# Altium project Plant_Monitoring_System.PrjPcb
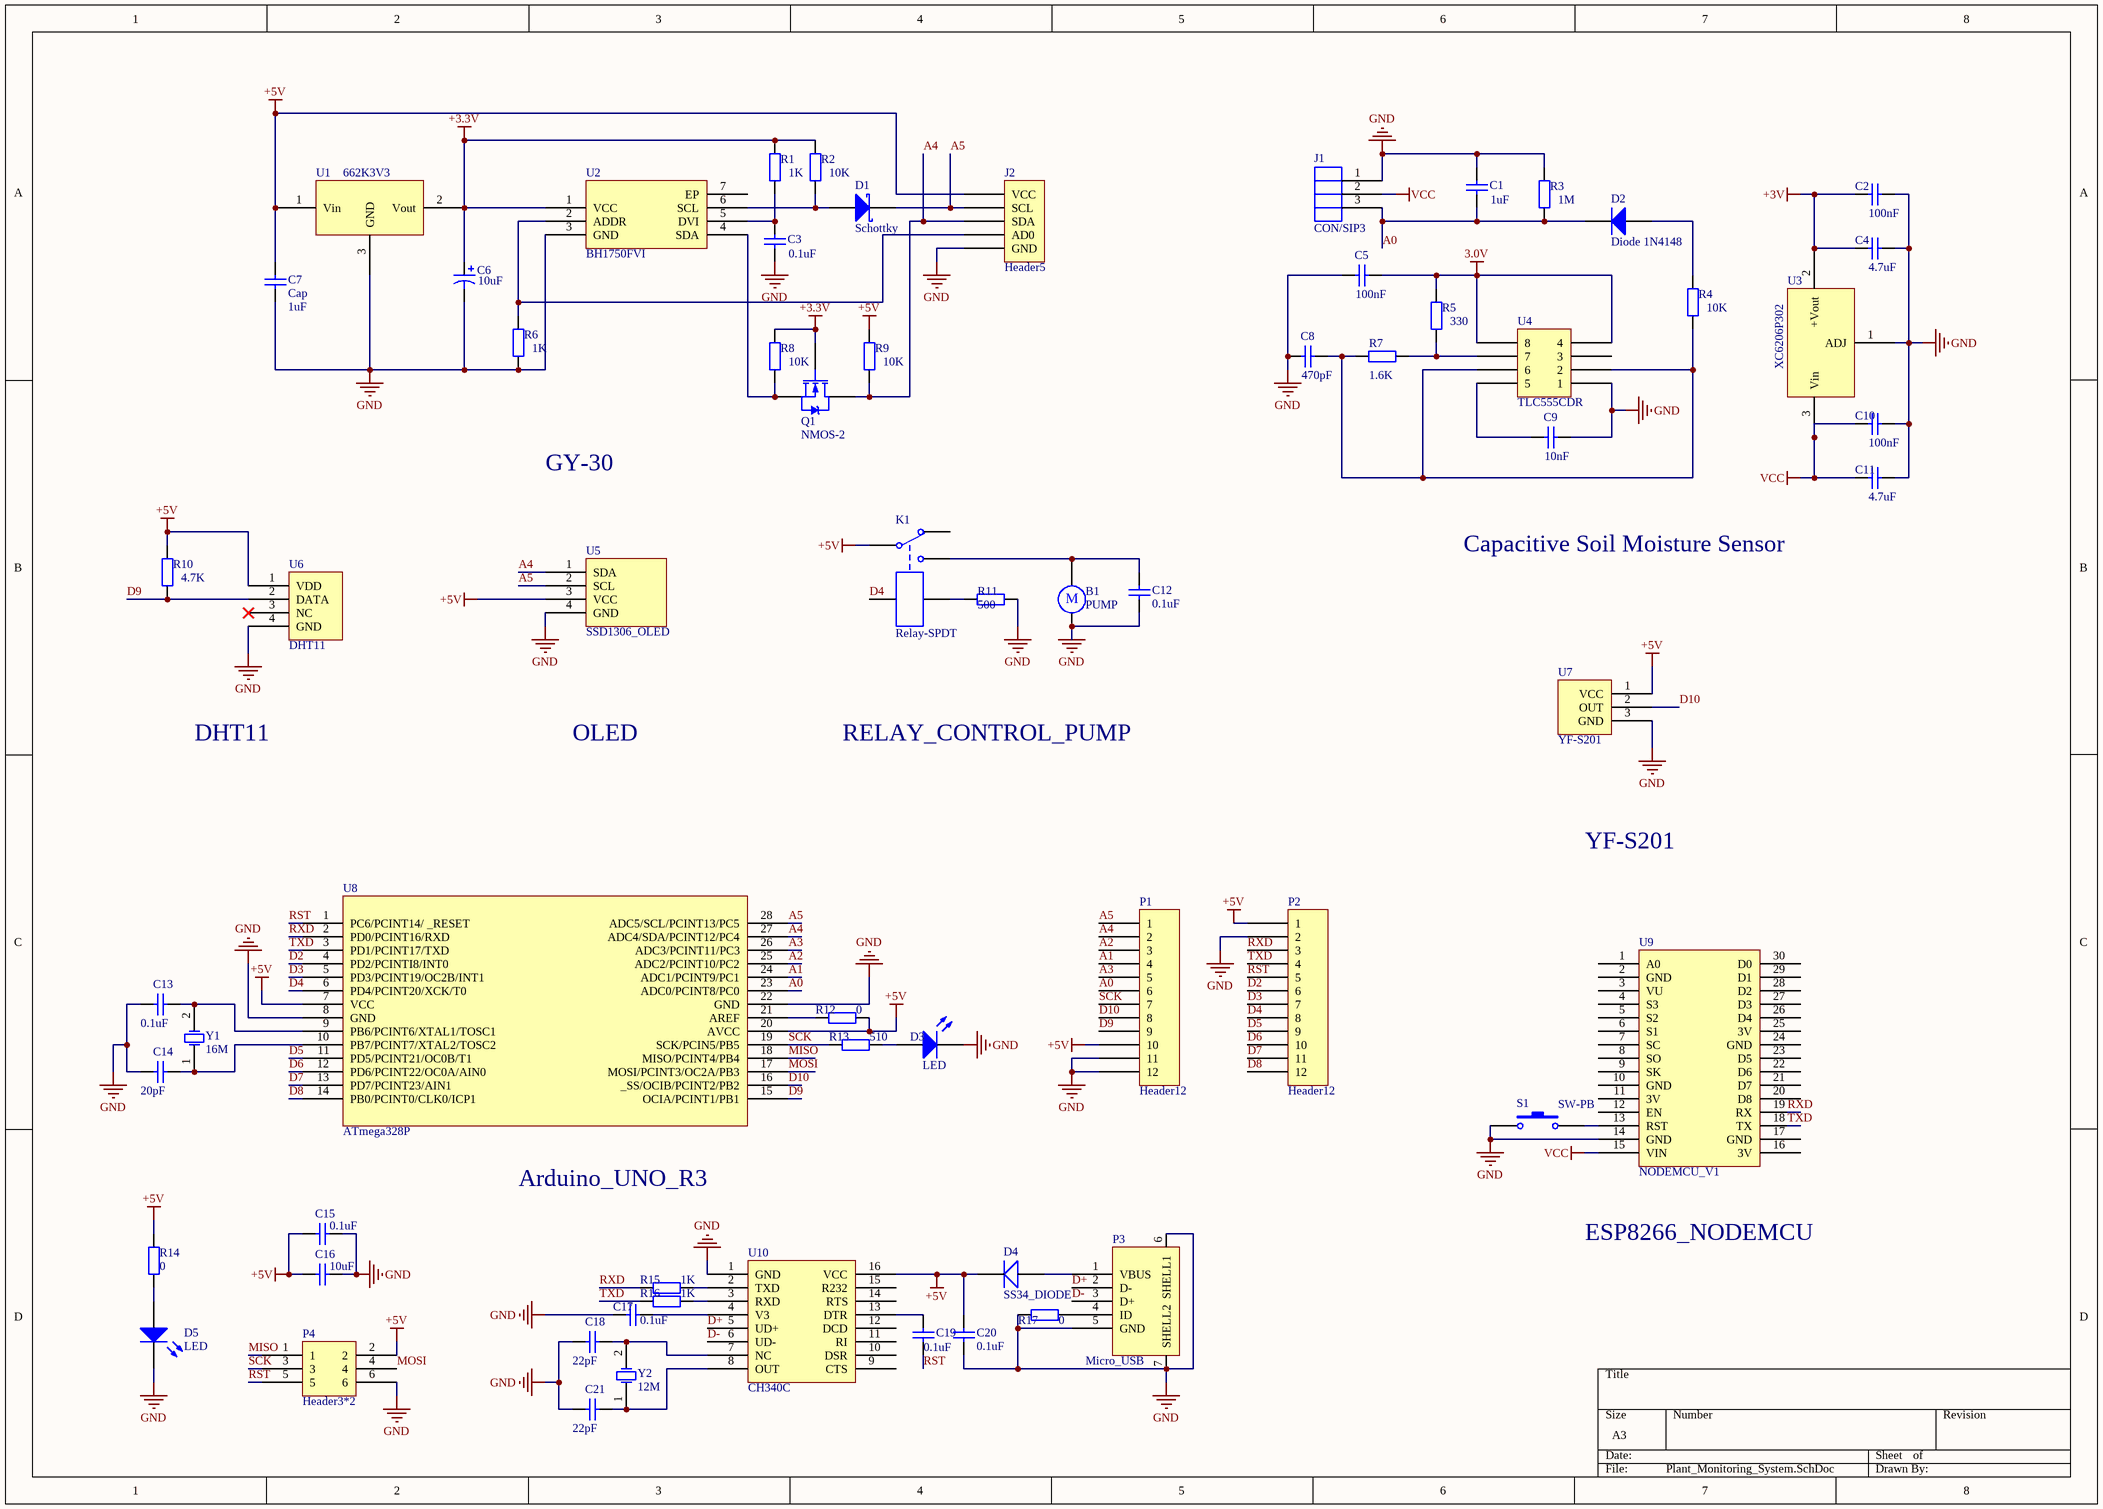
[diagram p0: Plant_Monitoring_System.SchDoc]
1 sheet, 65 parts. Net scope: global (net labels, ports and power ports of the same name join across sheets).

## Sheet Plant_Monitoring_System.SchDoc
size A3; SheetNumber: 1; SheetTotal: 1

### Parts
B1  PUMP  [RB5-10.5]
C1  value 1uF  [RAD-0.3]
C2  value 100nF  [RAD-0.3]
C3  value 0.1uF  [RAD-0.3]
C4  value 4.7uF  [RAD-0.3]
C5  value 100nF  [RAD-0.3]
C6  value 10uF  [RB7.6-15]
C7  Cap  value 1uF  [RAD-0.3]
C8  value 470pF  [RAD-0.3]
C9  value 10nF  [RAD-0.3]
C10  value 100nF  [RAD-0.3]
C11  value 4.7uF  [RAD-0.3]
C12  value 0.1uF  [RAD-0.3]
C13  value 0.1uF  [RAD-0.3]
C14  value 20pF  [RAD-0.3]
C15  value 0.1uF  [RAD-0.3]
C16  value 10uF  [RAD-0.3]
C17  value 0.1uF  [RAD-0.3]
C18  value 22pF  [RAD-0.3]
C19  value 0.1uF  [RAD-0.3]
C20  value 0.1uF  [RAD-0.3]
C21  value 22pF  [RAD-0.3]
D1  Schottky  [SMB]
D2  Diode 1N4148  [DO-35]
D3  LED  [3.5X2.8X1.9]
D4  SS34_DIODE
D5  LED  [3.5X2.8X1.9]
J1  CON/SIP3
J2  Header5
K1  Relay-SPDT  [MODULE5B]
P1  Header12
P2  Header12
P3  Micro_USB
P4  Header3*2
Q1  NMOS-2  [TO-220AB]
R1  value 1K  [AXIAL-0.4]
R2  value 10K  [AXIAL-0.4]
R3  value 1M  [AXIAL-0.4]
R4  value 10K  [AXIAL-0.4]
R5  value 330  [AXIAL-0.4]
R6  value 1K  [AXIAL-0.4]
R7  value 1.6K  [AXIAL-0.4]
R8  value 10K  [AXIAL-0.4]
R9  value 10K  [AXIAL-0.4]
R10  value 4.7K  [AXIAL-0.4]
R11  value 500  [AXIAL-0.4]
R12  value 0  [AXIAL-0.4]
R13  value 510  [AXIAL-0.4]
R14  value 0  [AXIAL-0.4]
R15  value 1K  [AXIAL-0.4]
R16  value 1K  [AXIAL-0.4]
R17  value 0  [AXIAL-0.4]
S1  SW-PB  [SPST-2]
U1  662K3V3
U2  BH1750FVI
U3  XC6206P302
U4  TLC555CDR
U5  SSD1306_OLED
U6  DHT11
U7  YF-S201
U8  ATmega328P
U9  NODEMCU_V1
U10  CH340C
Y1  16M  [R38]
Y2  12M  [R38]

### Nets
3.0V: C5.2 R5.2 U4.4 U4.8
+3.3V: C6.1 Q1.1(G) R1.2 R2.2 R8.2 U1.2(Vout) U2.1(VCC)
+3V: C2.1 C4.1 U3.2(+Vout)
+5V: C7.2 C15.1 C16.2 C20.1 J2.1(VCC) K1.1 P1.10 P2.1 P4.2 R9.2 R10.2 R12.2 R14.1 U1.1(Vin) U5.3(VCC) U6.1(VDD) U7.1(VCC) U8.7(VCC) U8.20(AVCC) U10.16(VCC)
GND: B1.2 C1.2 C2.2 C3.1 C4.2 C5.1 C6.2 C7.1 C8.1 C9.2 C10.2 C11.2 C12.2 C13.2 C14.2 C15.2 C16.1 C17.2 C18.2 C20.2 C21.2 D3.2(K) D5.2(K) J1.1 J2.5(GND) P1.11 P1.12 P2.2 P3.5(GND) P3.6(SHELL1) P3.7(SHELL2) P4.6 R3.2 R6.1 R11.2 R17.1 S1.1 U1.3(GND) U2.3(GND) U3.1(ADJ) U4.1 U5.4(GND) U6.4(GND) U7.3(GND) U8.8(GND) U8.22(GND) U9.14(GND) U10.1(GND)
VCC: C10.1 C11.1 J1.2 U3.3(Vin) U9.15(VIN)
A0: C1.1 D2.2(K) J1.3 P1.6 R3.1 U8.23(ADC0/PCINT8/PC0)
A1: P1.4 U8.24(ADC1/PCINT9/PC1)
A2: P1.3 U8.25(ADC2/PCINT10/PC2)
A3: P1.5 U8.26(ADC3/PCINT11/PC3)
A4: J2.3(SDA) P1.2 Q1.2(D) R9.1 U5.1(SDA) U8.27(ADC4/SDA/PCINT12/PC4)
A5: D1.2(K) J2.2(SCL) P1.1 U5.2(SCL) U8.28(ADC5/SCL/PCINT13/PC5)
D2: P2.6 U8.4(PD2/PCINTI8/INT0)
D3: P2.7 U8.5(PD3/PCINT19/OC2B/INT1)
D4: K1.4 P2.8 U8.6(PD4/PCINT20/XCK/T0)
D5: P2.9 U8.11(PD5/PCINT21/OC0B/T1)
D6: P2.10 U8.12(PD6/PCINT22/OC0A/AIN0)
D7: P2.11 U8.13(PD7/PCINT23/AIN1)
D8: P2.12 U8.14(PB0/PCINT0/CLK0/ICP1)
D9: P1.9 R10.1 U6.2(DATA) U8.15(OCIA/PCINT1/PB1)
D10: P1.8 U7.2(OUT) U8.16(_SS/OCIB/PCINT2/PB2)
D+: P3.2(D-) U10.5(UD+)
D-: P3.3(D+) U10.6(UD-)
MISO: P4.1 U8.18(MISO/PCINT4/PB4)
MOSI: P4.4 U8.17(MOSI/PCINT3/OC2A/PB3)
RST: C19.1 P2.5 P4.5 U8.1(PC6/PCINT14/__RESET)
RXD: P2.3 R15.1 U8.2(PD0/PCINT16/RXD) U9.19(RX)
SCK: P1.7 P4.3 R13.1 U8.19(SCK/PCIN5/PB5)
TXD: P2.4 R16.1 U8.3(PD1/PCINT17/TXD) U9.18(TX)
NetB1_1: B1.1 C12.1 K1.3
NetC3_2: C3.2 R1.1 U2.5(DVI)
NetC8_2: C8.2 R4.1 R7.1 U4.2 U4.6
NetC9_1: C9.1 U4.5
NetC13_1: C13.1 U8.9(PB6/PCINT6/XTAL1/TOSC1) Y1.2(OSC2)
NetC14_1: C14.1 U8.10(PB7/PCINT7/XTAL2/TOSC2) Y1.1(OSC1)
NetC17_1: C17.1 U10.4(V3)
NetC18_1: C18.1 U10.7(NC) Y2.2(OSC2)
NetC19_2: C19.2 U10.13(DTR)
NetC21_1: C21.1 U10.8(OUT) Y2.1(OSC1)
NetD1_1: D1.1(A) R2.1 U2.6(SCL)
NetD2_1: D2.1(A) R4.2
NetD3_1: D3.1(A) R13.2
NetD5_1: D5.1(A) R14.2
NetJ2_4: J2.4(AD0) R6.2 U2.2(ADDR)
NetK1_5: K1.5 R11.1
NetP3_4: P3.4(ID) R17.2
NetQ1_3: Q1.3(S) R8.1 U2.4(SDA)
NetR5_1: R5.1 R7.2 U4.7
NetR12_1: R12.1 U8.21(AREF)
NetR15_2: R15.2 U10.2(TXD)
NetR16_2: R16.2 U10.3(RXD)
NetS1_2: S1.2 U9.13(RST)

Not connected (* = marked no-connect by the designer): D4 ?1 ?2; K1 2; P3 1(VBUS); U2 7(EP); U4 3; U6 3(NC)*; U9 1(A0) 2(GND) 3(VU) 4(S3) 5(S2) 6(S1) 7(SC) 8(SO) 9(SK) 10(GND) 11(3V) 12(EN) 16(3V) 17(GND) 20(D8) 21(D7) 22(D6) 23(D5) 24(GND) 25(3V) 26(D4) 27(D3) 28(D2) 29(D1) 30(D0); U10 9(CTS) 10(DSR) 11(RI) 12(DCD) 14(RTS) 15(R232)

### Notes on the sheet
- GY-30
- Capacitive Soil Moisture Sensor
- DHT11
- OLED
- RELAY_CONTROL_PUMP
- YF-S201
- Arduino_UNO_R3
- ESP8266_NODEMCU
- (in symbol Motor) M

### Library data of the parts
B1 = Motor: Motor, General Kind; Published: 24-Mar-1999; LatestRevisionDate: 17-Jul-2002; LatestRevisionNote: Re-released for DXP Platform.; PackageReference: RB5-10.5; Publisher: Altium Limited; PackageDescription: Capacitor (Radial); 2 Leads
C1-C5 C7-C21 = Cap: Capacitor; Published: 8-Jun-2000; LatestRevisionDate: 17-Jul-2002; LatestRevisionNote: Re-released for DXP Platform.; PackageReference: RAD-0.3; Publisher: Altium Limited; PackageDescription: Radial Cap, Thru-Hole; 2 Leads; 0.3 in Pin Spacing
C6 = Cap Pol1: Polarized Capacitor (Radial); Published: 8-Jun-2000; LatestRevisionDate: 17-Jul-2002; LatestRevisionNote: Re-released for DXP Platform.; PackageReference: RB7.6-15; Publisher: Altium Limited; PackageDescription: Polarized Capacitor (Radial); 2 Leads
D1 = D Schottky: Schottky Diode; Published: 8-Jun-2000; LatestRevisionDate: 17-Jul-2002; LatestRevisionNote: Re-released for DXP Platform.; PackageReference: SMB; Publisher: Altium Limited; PackageDescription: DO-214-AA/SMB; 2 C-Bend Leads; Body 5.3 x 3.6 mm, inc. leads (LxW); Code_JEDEC: DO-214-AA
D2 = Diode 1N4148: High Conductance Fast Diode; Published: 8-Jun-2000; LatestRevisionDate: 17-Jul-2002; LatestRevisionNote: Re-released for DXP Platform.; DatasheetVersion: 1997; PackageReference: DO-35; Publisher: Altium Limited; PackageDescription: Diode, Axial; Body 3.8 x 1.9 mm (LxDia. max), Lead Dia. 0.53 mm (max); Code_JEDEC: DO-204-AH; ComponentLink1Description: Manufacturer Link; ComponentLink1URL: http://www.fairchildsemi.com/; ComponentLink2Description: Datasheet; ComponentLink2URL: http://www.fairchildsemi.com/ds/1N%2F1N4148.pdf
D3 D5 = LED3: Typical BLUE SiC LED; Published: 8-Jun-2000; LatestRevisionDate: 17-Dec-2003; LatestRevisionNote: PCB Footprint replaced.; DatasheetVersion: 16-Apr-2002; PackageVersion: 16-Apr-2002; PackageReference: 3.5X2.8X1.9; Publisher: Altium Limited; PackageDescription: SM LED; 2 C-Bend Leads; Body 3.5 x 2.8 x 1.9 mm, inc leads (LxWxH typ)
K1 = Relay-SPDT: Single-Pole Dual-Throw Relay; Published: 24-Mar-1999; LatestRevisionDate: 17-Jul-2002; LatestRevisionNote: Re-released for DXP Platform.; PackageReference: MODULE5B; Publisher: Altium Limited
Q1 = NMOS-2: N-Channel Power MOSFET; Note: Pin 2 is electrically connected to pin 4.; Published: 8-Jun-2000; LatestRevisionDate: 17-Jul-2002; LatestRevisionNote: Re-released for DXP Platform.; DatasheetVersion: PD-9.814; PackageVersion: Feb-1997; PackageReference: TO-220AB; Publisher: Altium Limited; PackageDescription: TO, Thru-Hole, Vertical, Heatsink Mounted; 3 In-Line Leads; Pitch 2.54 mm; ComponentLink1Description: Manufacturer Link; ComponentLink1URL: http://www.irf.com/
R1-R17 = Res2: Resistor; Published: 8-Jun-2000; LatestRevisionDate: 17-Jul-2002; LatestRevisionNote: Re-released for DXP Platform.; PackageReference: AXIAL-0.4; Publisher: Altium Limited; PackageDescription: Axial Device, Thru-Hole; 2 Leads; 0.4 in Pin Spacing
S1 = SW-PB: Switch; Published: 24-Mar-1999; LatestRevisionDate: 17-Jul-2002; LatestRevisionNote: Re-released for DXP Platform.; PackageReference: SPST-2; Publisher: Altium Limited; PackageDescription: Switch; 2 Leads
Y1 Y2 = XTAL: Crystal Oscillator; Published: 8-Jun-2000; LatestRevisionDate: 17-Jul-2002; LatestRevisionNote: Re-released for DXP Platform.; PackageReference: R38; Publisher: Altium Limited; PackageDescription: Crystal, Thru-Hole; 2 Leads; Body 3.1 x 8.2 mm (Dia.xH)